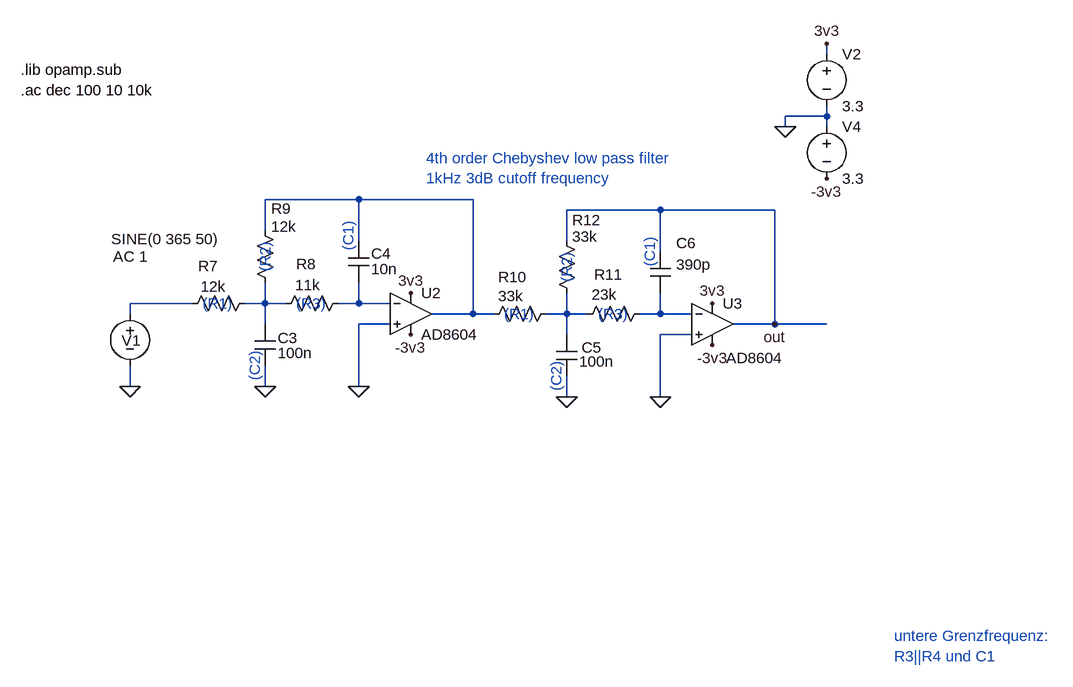
[diagram p0: schematic _mcL1_ChebyLP_4thOrder.asc]
_mcL1_ChebyLP_4thOrder.asc, the LTspice schematic file:
Version 4
SHEET 1 2304 1044
WIRE 1520 -208 1520 -224
WIRE 1520 -112 1520 -128
WIRE 1520 -112 1456 -112
WIRE 1456 -96 1456 -112
WIRE 1520 -96 1520 -112
WIRE 800 16 656 16
WIRE 976 16 800 16
WIRE 1264 32 1120 32
WIRE 1440 32 1264 32
WIRE 656 64 656 16
WIRE 800 80 800 16
WIRE 1120 80 1120 32
WIRE 1264 96 1264 32
WIRE 544 176 448 176
WIRE 656 176 656 144
WIRE 656 176 624 176
WIRE 688 176 656 176
WIRE 800 176 800 144
WIRE 800 176 768 176
WIRE 848 176 800 176
WIRE 448 192 448 176
WIRE 976 192 976 16
WIRE 976 192 912 192
WIRE 1008 192 976 192
WIRE 1120 192 1120 160
WIRE 1120 192 1088 192
WIRE 1152 192 1120 192
WIRE 1264 192 1264 160
WIRE 1264 192 1232 192
WIRE 1312 192 1264 192
WIRE 656 208 656 176
WIRE 848 208 800 208
WIRE 1440 208 1440 32
WIRE 1440 208 1376 208
WIRE 1520 208 1440 208
WIRE 1120 224 1120 192
WIRE 1312 224 1264 224
WIRE 448 304 448 272
WIRE 656 304 656 272
WIRE 800 304 800 208
WIRE 1120 320 1120 288
WIRE 1264 320 1264 224
FLAG 1520 -224 3v3
FLAG 656 304 0
FLAG 800 304 0
FLAG 1120 320 0
FLAG 1264 320 0
FLAG 1456 -96 0
FLAG 1520 -16 -3v3
FLAG 880 160 3v3
FLAG 1344 176 3v3
FLAG 880 224 -3v3
FLAG 1344 240 -3v3
FLAG 1440 208 out
FLAG 448 304 0
SYMBOL voltage 448 176 R0
WINDOW 123 -26 -72 Left 2
WINDOW 39 0 0 Left 0
WINDOW 0 -13 57 Left 2
WINDOW 3 -29 -99 Left 2
SYMATTR Value2 AC 1
SYMATTR InstName V1
SYMATTR Value SINE(0 365 50)
SYMBOL voltage 1520 -224 R0
WINDOW 123 0 0 Left 0
WINDOW 39 0 0 Left 0
SYMATTR InstName V2
SYMATTR Value 3.3
SYMBOL res 528 192 R270
WINDOW 0 58 40 VTop 2
WINDOW 3 58 48 VBottom 2
SYMATTR InstName R7
SYMATTR Value 12k
SYMBOL res 672 192 R270
WINDOW 0 61 47 VTop 2
WINDOW 3 60 50 VBottom 2
SYMATTR InstName R8
SYMATTR Value 11k
SYMBOL res 640 48 R0
WINDOW 0 25 -18 Left 2
WINDOW 3 25 10 Left 2
SYMATTR InstName R9
SYMATTR Value 12k
SYMBOL cap 640 208 R0
WINDOW 0 35 21 Left 2
WINDOW 3 35 44 Left 2
SYMATTR InstName C3
SYMATTR Value 100n
SYMBOL cap 784 80 R0
WINDOW 0 35 19 Left 2
WINDOW 3 35 43 Left 2
SYMATTR InstName C4
SYMATTR Value 10n
SYMBOL res 992 208 R270
WINDOW 0 57 45 VTop 2
WINDOW 3 59 42 VBottom 2
SYMATTR InstName R10
SYMATTR Value 33k
SYMBOL res 1136 208 R270
WINDOW 0 61 48 VTop 2
WINDOW 3 61 42 VBottom 2
SYMATTR InstName R11
SYMATTR Value 23k
SYMBOL res 1104 64 R0
WINDOW 0 24 -16 Left 2
WINDOW 3 24 9 Left 2
SYMATTR InstName R12
SYMATTR Value 33k
SYMBOL cap 1104 224 R0
WINDOW 0 39 20 Left 2
WINDOW 3 35 41 Left 2
SYMATTR InstName C5
SYMATTR Value 100n
SYMBOL cap 1248 96 R0
WINDOW 0 40 -13 Left 2
WINDOW 3 40 20 Left 2
SYMATTR InstName C6
SYMATTR Value 390p
SYMBOL voltage 1520 -112 R0
WINDOW 123 0 0 Left 0
WINDOW 39 0 0 Left 0
SYMATTR InstName V4
SYMATTR Value 3.3
SYMBOL Opamps\\AD8604 880 128 R0
SYMATTR InstName U2
SYMBOL Opamps\\AD8604 1344 144 R0
WINDOW 3 21 116 Left 2
SYMATTR InstName U3
TEXT 280 -184 Left 2 !.lib opamp.sub
TEXT 1624 688 Left 2 ;untere Grenzfrequenz:\nR3||R4 und C1
TEXT 560 176 Left 2 ;(R1)
TEXT 656 80 VRight 2 ;(R2)
TEXT 704 176 Left 2 ;(R3)
TEXT 1024 192 Left 2 ;(R1)
TEXT 1120 96 VRight 2 ;(R2)
TEXT 1168 192 Left 2 ;(R3)
TEXT 640 248 VRight 2 ;(C2)
TEXT 784 48 VRight 2 ;(C1)
TEXT 1248 72 VRight 2 ;(C1)
TEXT 1104 264 VRight 2 ;(C2)
TEXT 280 -152 Left 2 !.ac dec 100 10 10k
TEXT 904 -48 Left 2 ;4th order Chebyshev low pass filter\n1kHz 3dB cutoff frequency

The netlist it stands for:
* _mcL1_ChebyLP_4thOrder.asc
V1 N002 0 SINE(0 365 50) AC 1
V2 3v3 0 3.3
R7 N002 N003 12k
R8 N003 N004 11k
R9 N001 N003 12k
C3 N003 0 100n
C4 N001 N004 10n
R10 N001 N005 33k
R11 N005 N006 23k
R12 out N005 33k
C5 N005 0 100n
C6 out N006 390p
V4 0 -3v3 3.3
XU2 0 N004 3v3 -3v3 N001 AD8604  ; pins In+ In- V+ V- OUT
XU3 0 N006 3v3 -3v3 out AD8604  ; pins In+ In- V+ V- OUT
.lib opamp.sub
* untere Grenzfrequenz:
* R3||R4 und C1
* (R1)
* (R2)
* (R3)
* (R1)
* (R2)
* (R3)
* (C2)
* (C1)
* (C1)
* (C2)
.ac dec 100 10 10k
* 4th order Chebyshev low pass filter
* 1kHz 3dB cutoff frequency
.backanno
.end